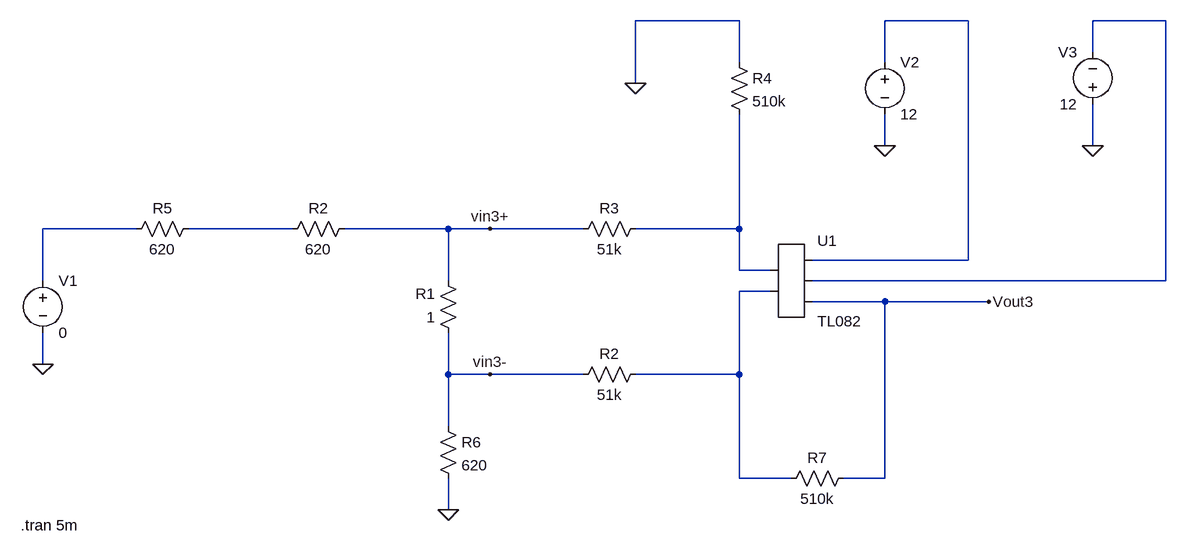
[diagram p0: schematic SimulacaoRelatorio1Part4TL082ComResistor.asc]
SimulacaoRelatorio1Part4TL082ComResistor.asc, the LTspice schematic file:
Version 4
SHEET 1 1108 680
WIRE 448 -176 288 -176
WIRE 800 -176 672 -176
WIRE 1104 -176 992 -176
WIRE 992 -128 992 -176
WIRE 448 -112 448 -176
WIRE 672 -112 672 -176
WIRE 288 -80 288 -176
WIRE 672 16 672 -32
WIRE 992 16 992 -48
WIRE -480 144 -624 144
WIRE -240 144 -400 144
WIRE 0 144 -160 144
WIRE 64 144 0 144
WIRE 208 144 64 144
WIRE 448 144 448 -32
WIRE 448 144 288 144
WIRE 800 192 800 -176
WIRE 800 192 560 192
WIRE 448 208 448 144
WIRE 496 208 448 208
WIRE -624 224 -624 144
WIRE 0 224 0 144
WIRE 1104 224 1104 -176
WIRE 1104 224 560 224
WIRE 496 240 448 240
WIRE 672 256 560 256
WIRE 832 256 672 256
WIRE -624 352 -624 304
WIRE 0 368 0 304
WIRE 64 368 0 368
WIRE 208 368 64 368
WIRE 448 368 448 240
WIRE 448 368 288 368
WIRE 0 448 0 368
WIRE 448 528 448 368
WIRE 528 528 448 528
WIRE 672 528 672 256
WIRE 672 528 608 528
WIRE 0 576 0 528
FLAG -624 352 0
FLAG 288 -80 0
FLAG 672 16 0
FLAG 992 16 0
FLAG 832 256 Vout3
FLAG 0 576 0
FLAG 64 144 vin3+
FLAG 64 368 vin3-
SYMBOL voltage -624 208 R0
SYMATTR InstName V1
SYMATTR Value 0
SYMBOL res 16 320 R180
WINDOW 0 36 76 Left 2
WINDOW 3 36 40 Left 2
SYMATTR InstName R1
SYMATTR Value 1
SYMBOL res 192 384 R270
WINDOW 0 32 56 VTop 2
WINDOW 3 0 56 VBottom 2
SYMATTR InstName R2
SYMATTR Value 51k
SYMBOL res 304 128 R90
WINDOW 0 0 56 VBottom 2
WINDOW 3 32 56 VTop 2
SYMATTR InstName R3
SYMATTR Value 51k
SYMBOL res 432 -128 R0
SYMATTR InstName R4
SYMATTR Value 510k
SYMBOL voltage 672 -128 R0
SYMATTR InstName V2
SYMATTR Value 12
SYMBOL voltage 992 -32 R180
WINDOW 0 24 96 Left 2
WINDOW 3 24 16 Left 2
WINDOW 123 0 0 Left 0
WINDOW 39 0 0 Left 0
SYMATTR InstName V3
SYMATTR Value 12
SYMBOL res -384 128 R90
WINDOW 0 0 56 VBottom 2
WINDOW 3 32 56 VTop 2
SYMATTR InstName R5
SYMATTR Value 620
SYMBOL res -16 432 R0
SYMATTR InstName R6
SYMATTR Value 620
SYMBOL res 624 512 R90
WINDOW 0 0 56 VBottom 2
WINDOW 3 32 56 VTop 2
SYMATTR InstName R7
SYMATTR Value 510k
SYMBOL AutoGenerated\\TL082 528 224 R0
SYMATTR InstName U1
SYMBOL res -144 128 R90
WINDOW 0 0 56 VBottom 2
WINDOW 3 32 56 VTop 2
SYMATTR InstName R2
SYMATTR Value 620
TEXT -658 600 Left 2 !.tran 5m

The netlist it stands for:
* SimulacaoRelatorio1Part4TL082ComResistor.asc
V1 N003 0 0
R1 vin3- vin3+ 1
R2 vin3- N006 51k
R3 N005 vin3+ 51k
R4 0 N005 510k
V2 N001 0 12
V3 0 N002 12
R5 N004 N003 620
R6 vin3- 0 620
R7 Vout3 N006 510k
* U1: TL082 (symbol AutoGenerated\TL082 not available, pins judged from their places): pin1=N005 pin2=N006 pin3=N001 pin4=N002 pin5=Vout3
R2 vin3+ N004 620
.tran 5m
.backanno
.end